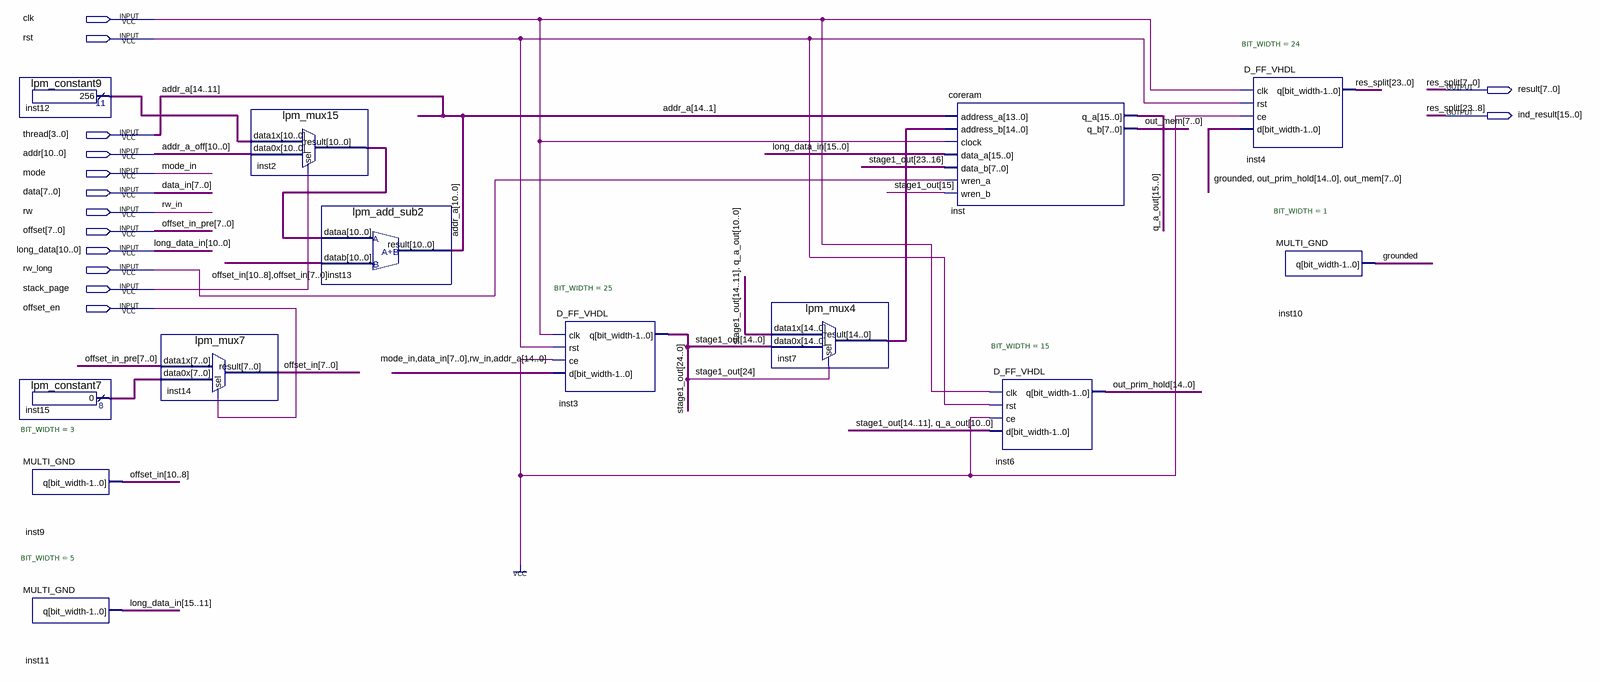
[diagram p0: schematic sheet]
// Quartus schematic threadMem.bdf as structural Verilog: 13 symbols, 14 pins
module threadMem (
  input  clk,
  input  rst,
  input  [3:0] thread,
  input  [10:0] addr,
  input  mode,
  input  [7:0] data,
  input  rw,
  input  [7:0] offset,
  input  [10:0] long_data,
  input  rw_long,
  input  stack_page,
  input  offset_en,
  output [7:0] result,
  output [15:0] ind_result
);

  wire grounded;
  wire [7:0] inst15_result, out_mem;
  wire [10:0] addr_a, inst2_result, inst12_result, offset_in;
  wire [14:0] inst7_result, out_prim_hold;
  wire [15:0] q_a_out;
  wire [15:11] long_data_in;
  wire [24:0] stage1_out;

  lpm_constant9 inst12 (.result(inst12_result));
  lpm_constant7 inst15 (.result(inst15_result));
  MULTI_GND #(.BIT_WIDTH(3)) inst9 (.q(offset_in[10:8]));
  MULTI_GND #(.BIT_WIDTH(5)) inst11 (.q(long_data_in));
  lpm_mux7 inst14 (.data1x(offset), .data0x(inst15_result), .sel(offset_en), .result(offset_in[7:0]));
  lpm_mux15 inst2 (.data1x(inst12_result), .data0x(addr), .sel(stack_page), .result(inst2_result));
  lpm_add_sub2 inst13 (.dataa(inst2_result), .datab(offset_in), .result(addr_a));
  D_FF_VHDL #(.BIT_WIDTH(25)) inst3 (
    .clk(clk), .rst(rst), .ce(1'b1), .d({mode, data, rw, thread, addr_a}), .q(stage1_out));
  lpm_mux4 inst7 (
    .data1x({stage1_out[14:11], q_a_out[10:0]}), .data0x(stage1_out[14:0]), .sel(stage1_out[24]),
    .result(inst7_result));
  coreram inst (
    .address_a({thread, addr_a[10:1]}), .address_b(inst7_result), .clock(clk),
    .data_a({long_data_in, long_data}), .data_b(stage1_out[23:16]), .wren_a(rw_long),
    .wren_b(stage1_out[15]), .q_a(q_a_out), .q_b(out_mem));
  D_FF_VHDL #(.BIT_WIDTH(15)) inst6 (
    .clk(clk), .rst(rst), .ce(1'b1), .d({stage1_out[14:11], q_a_out[10:0]}), .q(out_prim_hold));
  D_FF_VHDL #(.BIT_WIDTH(24)) inst4 (
    .clk(clk), .rst(rst), .ce(1'b1), .d({grounded, out_prim_hold, out_mem}), .q({ind_result, result}));
  MULTI_GND #(.BIT_WIDTH(1)) inst10 (.q(grounded));

  // Other names for the same wires on the sheet: addr_a_off[10:0] = addr; data_in[7:0] = data;
  //   long_data_in[10:0] = long_data; mode_in = mode; offset_in_pre[7:0] = offset;
  //   res_split[23:0] = {ind_result, result}; rw_in = rw; addr_a[14:11] = thread
endmodule
